# Altium schematic sheet FRDM-TFC.SchDoc: TRW-TFC
size D; SheetNumber: 1; SheetTotal: 2
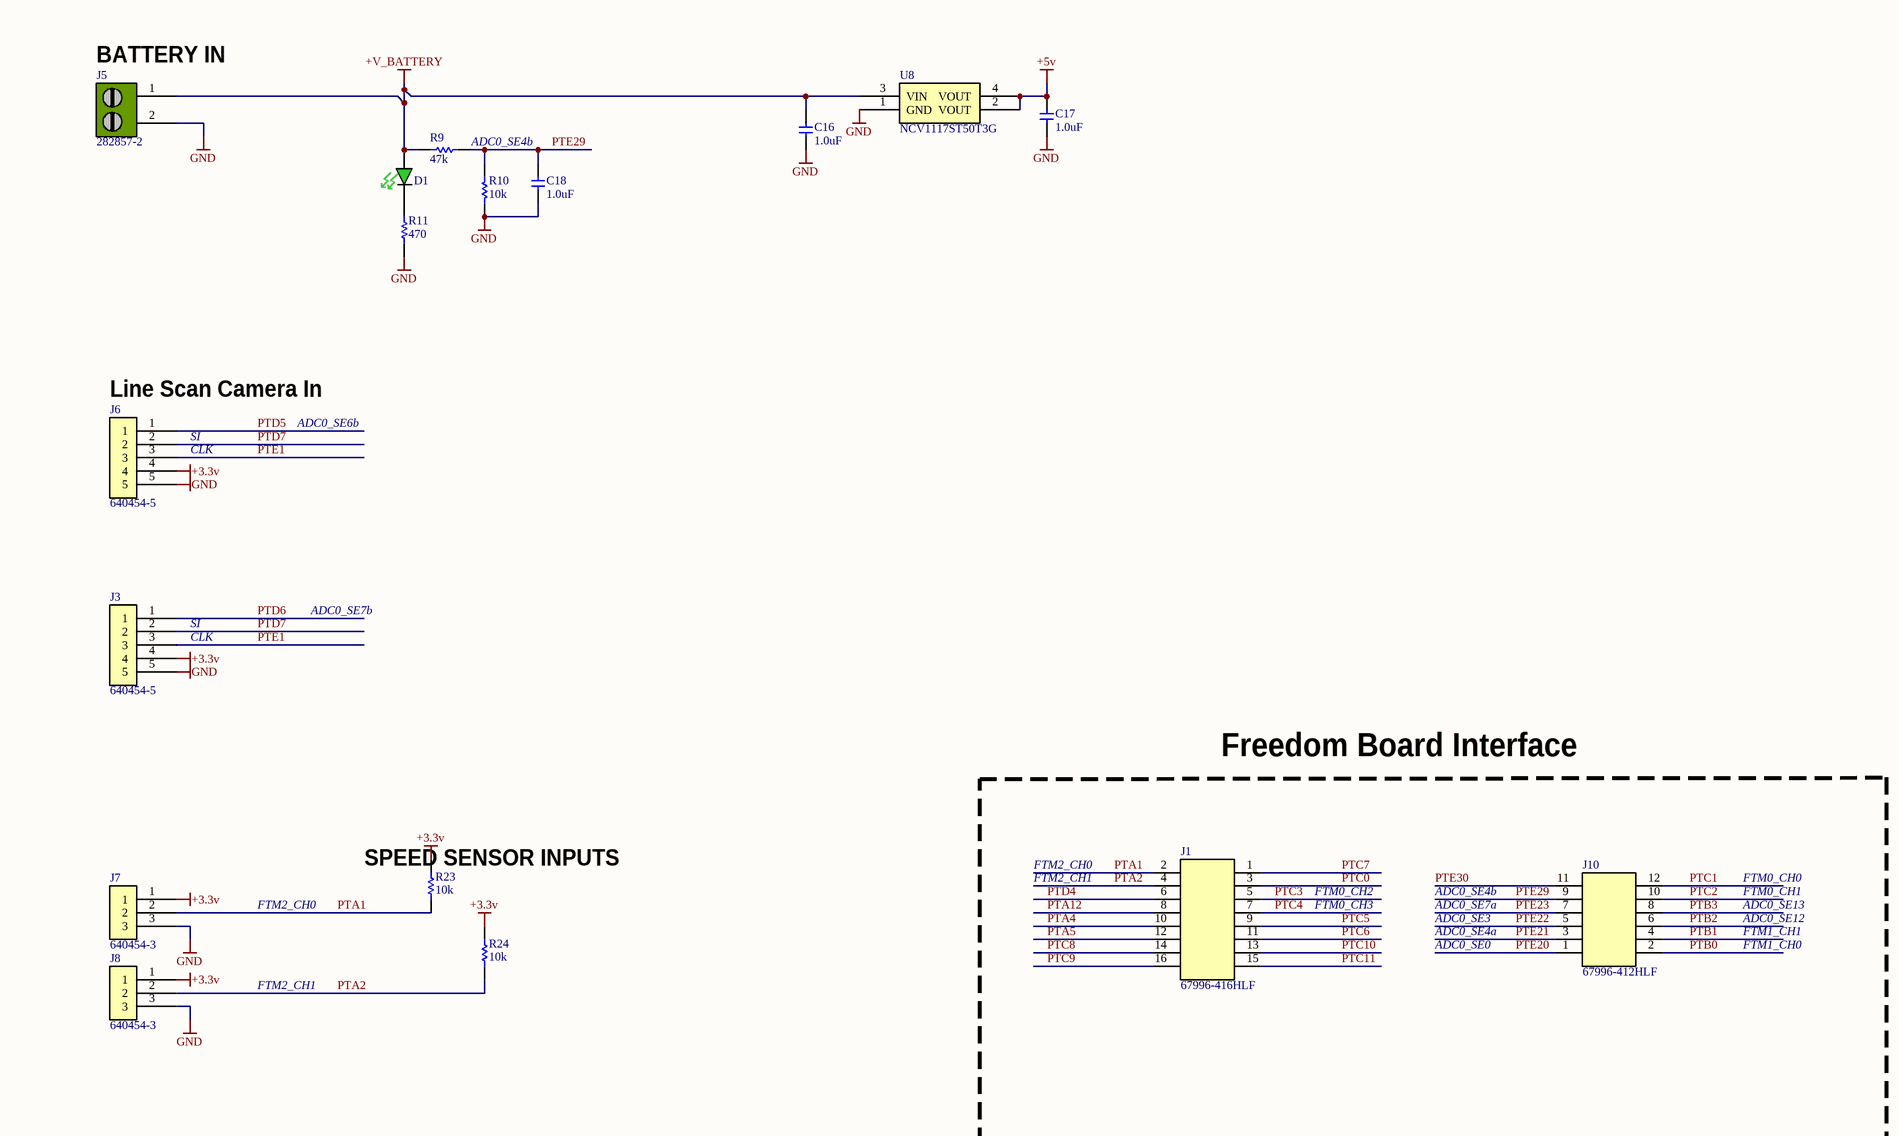
[diagram p0: FRDM-TFC.SchDoc, top left]
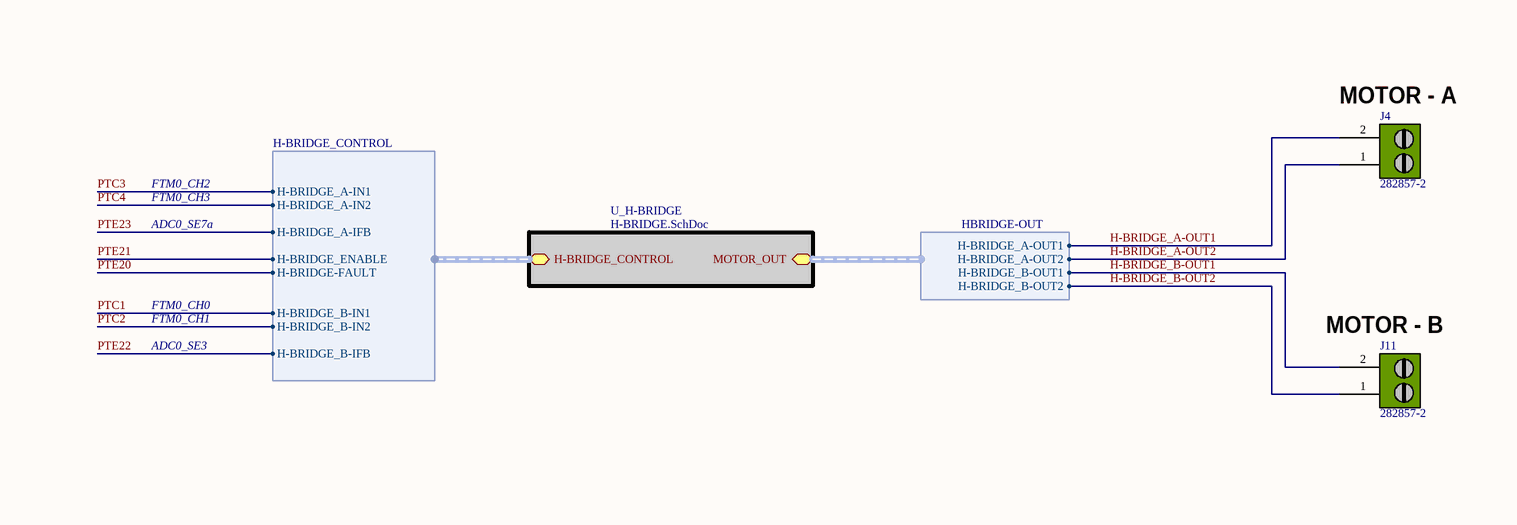
[diagram p1: FRDM-TFC.SchDoc, top right]
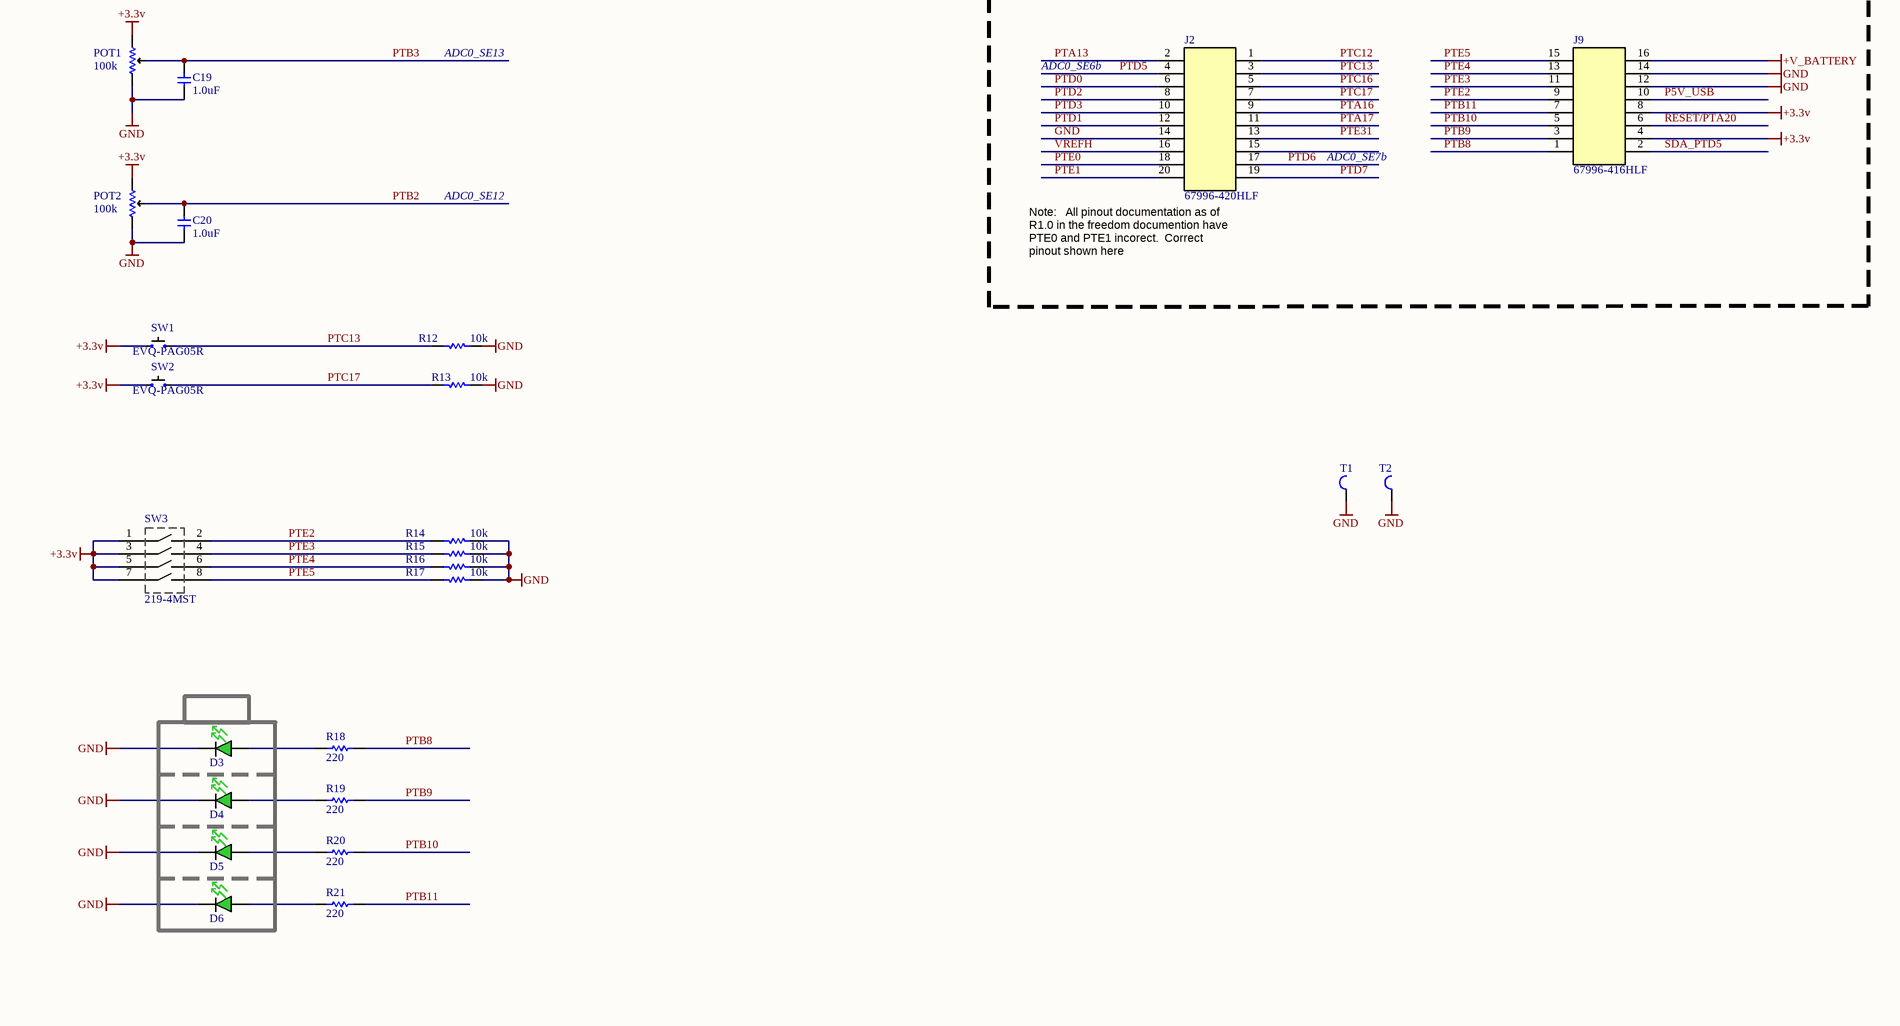
[diagram p2: FRDM-TFC.SchDoc, bottom left]
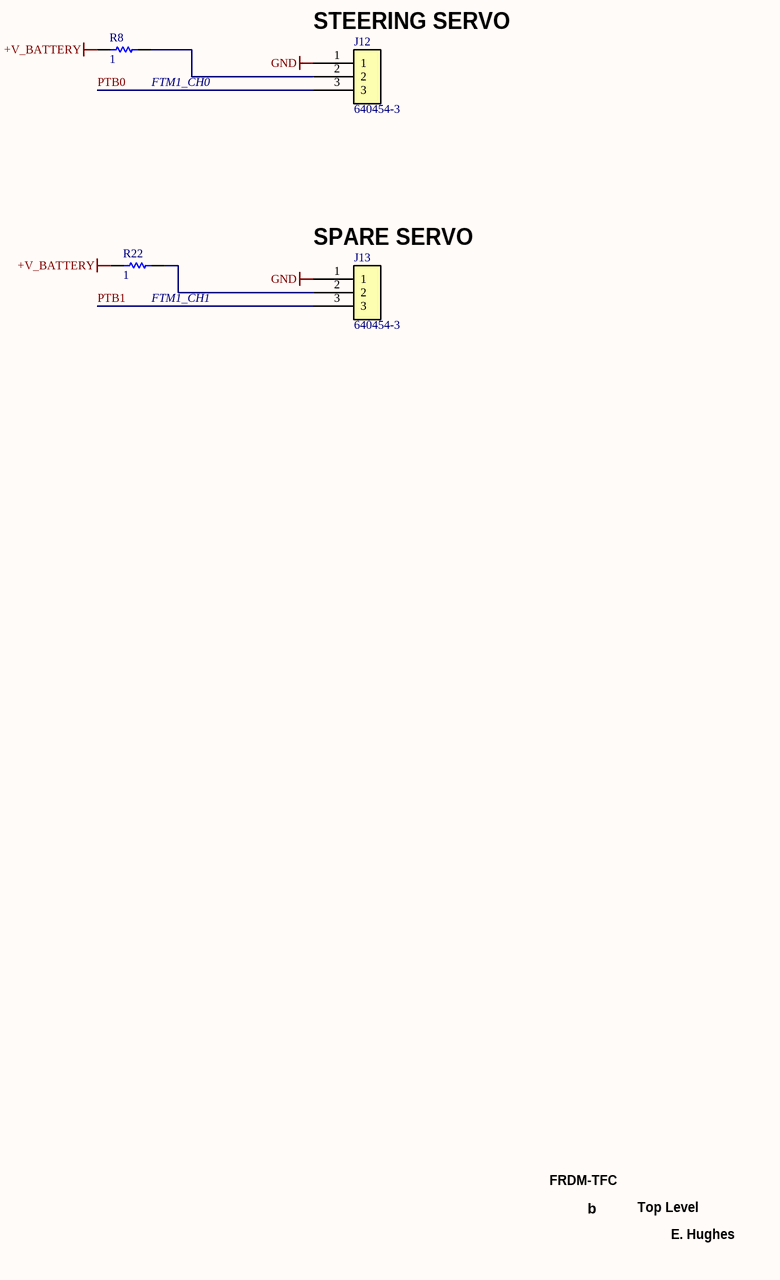
[diagram p3: FRDM-TFC.SchDoc, bottom right]

## Parts
C16  1.0uF  [C0805]
C17  1.0uF  [C0805]
C18  1.0uF  [C0805]
C19  1.0uF  [C0805]
C20  1.0uF  [C0805]
D1  (no value)  [LED_0805 - GREEN]
D3  (no value)  [LED_0805 - GREEN]
D4  (no value)  [LED_0805 - GREEN]
D5  (no value)  [LED_0805 - GREEN]
D6  (no value)  [LED_0805 - GREEN]
J1  67996-416HLF  [67996-416HLF]
J2  67996-420HLF  [67996-420HLF]
J3  640454-5  [640454-5]
J4  282857-2  [282857-2]
J5  282857-2  [282857-2]
J6  640454-5  [640454-5]
J7  640454-3  [640454-3]
J8  640454-3  [640454-3]
J9  67996-416HLF  [67996-416HLF]
J10  67996-412HLF  [67996-412HLF]
J11  282857-2  [282857-2]
J12  640454-3  [640454-3]
J13  640454-3  [640454-3]
POT1  100k  [3386P]
POT2  100k  [3386P]
R8  1  [R2512]
R9  47k  [R0603]
R10  10k  [R0603]
R11  470  [R0603]
R12  10k  [R0603]
R13  10k  [R0603]
R14  10k  [R0603]
R15  10k  [R0603]
R16  10k  [R0603]
R17  10k  [R0603]
R18  220  [R0603]
R19  220  [R0603]
R20  220  [R0603]
R21  220  [R0603]
R22  1  [R2512]
R23  10k  [R0603]
R24  10k  [R0603]
SW1  EVQ-PAG05R  [EVQ-PAG05R]
SW2  EVQ-PAG05R  [EVQ-PAG05R]
SW3  219-4MST  [219-4MST]
T1  PC TEST POINT MINIATURE SMT  [SMT_TEST_5015]  (value not drawn)
T2  PC TEST POINT MINIATURE SMT  [SMT_TEST_5015]  (value not drawn)
U8  NCV1117ST50T3G  [SOT223]

## Blocks framed on the sheet
Freedom Board Interface: J1 J2 J9 J10

## Sub-sheets
U_H-BRIDGE = H-BRIDGE.SchDoc: MOTOR_OUT (harness HBRIDGE-OUT), H-BRIDGE_CONTROL (harness H-BRIDGE_CONTROL)

## Harnesses
HBRIDGE-OUT: H-BRIDGE_A-OUT1, H-BRIDGE_A-OUT2, H-BRIDGE_B-OUT1, H-BRIDGE_B-OUT2
H-BRIDGE_CONTROL: H-BRIDGE_A-IN2, H-BRIDGE_A-IN1, H-BRIDGE_ENABLE, H-BRIDGE-FAULT, H-BRIDGE_A-IFB, H-BRIDGE_B-IN2, H-BRIDGE_B-IN1, H-BRIDGE_B-IFB

## Nets
+3.3v: J3.4 J6.4 J7.1 J8.1 J9.4 J9.8 POT1.1 POT2.1 R23.2 R24.2 SW1.A SW2.A SW3.1(A1) SW3.3(A2) SW3.5(A3) SW3.7(A4)
+5v: C17.1 U8.2(VOUT) U8.4(VOUT)
+V_BATTERY: C16.1 D1.A J5.1 J9.16 R8.1 R9.1 R22.1 U8.3(VIN)
GND: C16.2 C17.2 C18.1 C19.1 C20.1 D3.C D4.C D5.C D6.C J2.14 J3.5 J5.2 J6.5 J7.3 J8.3 J9.12 J9.14 J12.1 J13.1 POT1.3 POT2.3 R10.2 R11.1 R12.1 R13.1 R14.1 R15.1 R16.1 R17.1 T1.1 T2.1 U8.1(GND)
H-BRIDGE_A-OUT1: J4.2 ; sheet U_H-BRIDGE/MOTOR_OUT.H-BRIDGE_A-OUT1
H-BRIDGE_A-OUT2: J4.1 ; sheet U_H-BRIDGE/MOTOR_OUT.H-BRIDGE_A-OUT2
H-BRIDGE_B-OUT1: J11.2 ; sheet U_H-BRIDGE/MOTOR_OUT.H-BRIDGE_B-OUT1
H-BRIDGE_B-OUT2: J11.1 ; sheet U_H-BRIDGE/MOTOR_OUT.H-BRIDGE_B-OUT2
P5V_USB: J9.10
PTA1: J1.2 J7.2 R23.1
PTA2: J1.4 J8.2 R24.1
PTA4: J1.10
PTA5: J1.12
PTA12: J1.8
PTA13: J2.2
PTA16: J2.9
PTA17: J2.11
PTB0: J10.2 J12.3
PTB1: J10.4 J13.3
PTB2: C20.2 J10.6 POT2.2
PTB3: C19.2 J10.8 POT1.2
PTB8: J9.1 R18.1
PTB9: J9.3 R19.1
PTB10: J9.5 R20.1
PTB11: J9.7 R21.1
PTC0: J1.3
PTC1: J10.12 ; sheet U_H-BRIDGE/H-BRIDGE_CONTROL.H-BRIDGE_B-IN1
PTC2: J10.10 ; sheet U_H-BRIDGE/H-BRIDGE_CONTROL.H-BRIDGE_B-IN2
PTC3: J1.5 ; sheet U_H-BRIDGE/H-BRIDGE_CONTROL.H-BRIDGE_A-IN1
PTC4: J1.7 ; sheet U_H-BRIDGE/H-BRIDGE_CONTROL.H-BRIDGE_A-IN2
PTC5: J1.9
PTC6: J1.11
PTC7: J1.1
PTC8: J1.14
PTC9: J1.16
PTC10: J1.13
PTC11: J1.15
PTC12: J2.1
PTC13: J2.3 R12.2 SW1.B
PTC16: J2.5
PTC17: J2.7 R13.2 SW2.B
PTD0: J2.6
PTD1: J2.12
PTD2: J2.8
PTD3: J2.10
PTD4: J1.6
PTD5: J2.4 J6.1
PTD6: J2.17 J3.1
PTD7: J2.19 J3.2 J6.2
PTE0: J2.18
PTE1: J2.20 J3.3 J6.3
PTE2: J9.9 R14.2 SW3.2(B1)
PTE3: J9.11 R15.2 SW3.4(B2)
PTE4: J9.13 R16.2 SW3.6(B3)
PTE5: J9.15 R17.2 SW3.8(B4)
PTE20: J10.1 ; sheet U_H-BRIDGE/H-BRIDGE_CONTROL.H-BRIDGE-FAULT
PTE21: J10.3 ; sheet U_H-BRIDGE/H-BRIDGE_CONTROL.H-BRIDGE_ENABLE
PTE22: J10.5 ; sheet U_H-BRIDGE/H-BRIDGE_CONTROL.H-BRIDGE_B-IFB
PTE23: J10.7 ; sheet U_H-BRIDGE/H-BRIDGE_CONTROL.H-BRIDGE_A-IFB
PTE29: C18.2 J10.9 R9.2 R10.1
PTE30: J10.11
PTE31: J2.13
RESET/PTA20: J9.6
SDA_PTD5: J9.2
VREFH: J2.16
NetD1_C: D1.C R11.2
NetD3_A: D3.A R18.2
NetD4_A: D4.A R19.2
NetD5_A: D5.A R20.2
NetD6_A: D6.A R21.2
NetJ12_2: J12.2 R8.2
NetJ13_2: J13.2 R22.2

Not connected (* = marked no-connect by the designer): J2 15

## Notes on the sheet
- (near J5) BATTERY IN
- (near R9) ADC0_SE4b
- (near J6) Line Scan Camera In
- SI
- CLK
- ADC0_SE6b
- ADC0_SE7b
- (near J4) MOTOR - A
- (near J7) SPEED SENSOR INPUTS
- FTM2_CH0
- FTM0_CH2
- FTM2_CH1
- FTM0_CH3
- ADC0_SE4b
- ADC0_SE3
- ADC0_SE4a
- ADC0_SE7a
- FTM0_CH0
- FTM0_CH1
- FTM1_CH1
- ADC0_SE12
- ADC0_SE13
- ADC0_SE0
- FTM1_CH0
- (near J11) MOTOR - B
- (near J12) STEERING SERVO
- (near R8) FTM1_CH0
- (near J2) Note:   All pinout documentation as of R1.0 in the freedom documention have PTE0 and PTE1 incorect.  Correct pinout shown here
- (near R22) FTM1_CH1
- (near J13) SPARE SERVO
- FRDM-TFC
- b
- Top Level
- E. Hughes
- -1
- 2
- Wavenumber
- Technologies
- pl
- Rev:
- Sheet
- of

## Library data of the parts
C16-C20 = UMK212BJ105KG-T: CAP CER 1.0UF 50V X5R 0805; Manufacturer: Taiyo Yuden; Capacitance: 1.0µF; Tolerance: ±10%; Manufacturer Part Number: UMK212BJ105KG-T; Value: CAP CER 1.0UF 50V X5R 0805; Supplier 1: Digi-Key; Supplier Part Number 1: 587-2229-1-ND; RoHS: RoHS Compliant; Category: Capacitors; Stock 1: 302348; Pricing 1: 1=0.39, 10=0.26, 100=0.104, 250=0.07476, 500=0.0533, 1000=0.039 (USD); Voltage - Rated: 50V; Temperature Coefficient: X5R; Mounting Type: Surface Mount, MLCC; Operating Temperature: -55°C ~ 85°C; Features: -; Applications: General Purpose; Ratings: -; Package / Case: 0805 (2012 Metric); Size / Dimension: 0.079" L x 0.049" W (2.00mm x 1.25mm); Lead Spacing: -; Thickness: 1.25mm; Packaging: Cut Tape (CT); Lead Style: -; ComponentLink1URL: http://www.yuden.co.jp/ut/product/pdf/mlcc_all_e.pdf; ComponentLink1Description: http://www.yuden.co.jp/ut/product/pdf/mlcc_all_e.pdf
D1 D3-D6 = APT2012CGCK: LED 2X1.2MM 570NM GN WTR CLR SMD; Manufacturer: Kingbright Corp; Color: Green; Current - Test: 20mA; Wavelength - Peak: 574nm; Millicandela Rating: 50mcd; Voltage - Forward (Vf) Typ: 2.1V; Lens Type: Clear; Lens Style/Size: Rectangle, 1.3mm x 1.25mm; Viewing Angle: 120°; Supplier 1: Digi-Key; Supplier Part Number 1: 754-1127-1-ND; Manufacturer Part Number: APT2012CGCK; RoHS: RoHS Compliant; Category: Optoelectronics; Stock 1: 53690; Pricing 1: 1=0.17, 10=0.124, 25=0.0992, 100=0.0908, 250=0.08252, 500=0.07426, 1000=0.066 (USD); Luminous Flux @ Current - Test: -; Wavelength - Dominant: 570nm; Size / Dimension: 2.00mm L x 1.25mm W; Height: 0.75mm; Package / Case: 0805 (2012 Metric); Mounting Type: Surface Mount; Packaging: Cut Tape (CT); ComponentLink1URL: http://www.us.kingbright.com/images/catalog/SPEC/APT2012CGCK.pdf; ComponentLink1Description: http://www.us.kingbright.com/images/catalog/SPEC/APT2012CGCK.pdf; Supplier 2: Digi-Key; Supplier Part Number 2: 754-1124-1-ND
J1 J9 = 67996-416HLF: CONN HEADER 16POS .100 STR TIN; Manufacturer: FCI; Connector Type: Header, Unshrouded; Number of Positions: 16; Number of Positions Loaded: All; Pitch: 0.100" (2.54mm); Manufacturer Part Number: 67996-416HLF; RoHS: RoHS Compliant; Category: Connectors, Interconnects; Contact Type: Male Pin; Number of Rows: 2; Row Spacing: 0.100" (2.54mm); Contact Mating Length: 0.230" (5.84mm); Mounting Type: Through Hole; Termination: Solder; Fastening Type: -; Features: -; Contact Finish: Tin; Contact Finish Thickness: 100µin (2.54µm); Color: Black; Packaging: Bulk; ComponentLink1URL: http://portal.fciconnect.com/Comergent//fci/drawing/67996.pdf; ComponentLink1Description: http://portal.fciconnect.com/Comergent//fci/drawing/67996.pdf; Value: 67996-416HLF; Supplier 1: Digi-Key; Supplier Part Number 1: 609-3220-ND; Stock 1: 1589; Pricing 1: 1=0.56, 10=0.521, 25=0.4684, 50=0.4164, 100=0.3991, 250=0.36436, 500=0.347, 1000=0.28628, 2500=0.26025 (USD)
J2 = 67996-420HLF: CONN HEADER 20POS .100 STR TIN; Manufacturer: FCI; Connector Type: Header, Unshrouded; Number of Positions: 20; Number of Positions Loaded: All; Pitch: 0.100" (2.54mm); Supplier 1: Digi-Key; Supplier Part Number 1: 609-3221-ND; Manufacturer Part Number: 67996-420HLF; RoHS: RoHS Compliant; Category: Connectors, Interconnects; Stock 1: 596; Pricing 1: 1=0.66, 10=0.619, 25=0.5572, 50=0.4952, 100=0.4745, 250=0.43324, 500=0.4126, 1000=0.3404, 2500=0.30945 (USD); Contact Type: Male Pin; Number of Rows: 2; Row Spacing: 0.100" (2.54mm); Contact Mating Length: 0.230" (5.84mm); Mounting Type: Through Hole; Termination: Solder; Fastening Type: -; Features: -; Contact Finish: Tin; Contact Finish Thickness: 100µin (2.54µm); Color: Black; Packaging: Bulk; ComponentLink1URL: http://portal.fciconnect.com/Comergent//fci/drawing/67996.pdf; ComponentLink1Description: http://portal.fciconnect.com/Comergent//fci/drawing/67996.pdf
J3 J6 = 640454-5: CONN HEADER VERT 5POS .100 TIN; Manufacturer: TE Connectivity; Connector Type: Header, Unshrouded; Number of Positions: 5; Number of Positions Loaded: All; Pitch: 0.100" (2.54mm); Supplier 1: Digi-Key; Supplier Part Number 1: A19432-ND; Manufacturer Part Number: 640454-5; RoHS: RoHS Compliant; Category: Connectors, Interconnects; Stock 1: 21698; Pricing 1: 1=0.27, 10=0.254, 25=0.218, 50=0.1854, 100=0.1781, 250=0.15996, 500=0.15268, 1000=0.12723, 2500=0.11632 (USD); Contact Type: Male Pin; Number of Rows: 1; Row Spacing: -; Contact Mating Length: 0.295" (7.49mm); Mounting Type: Through Hole; Termination: Solder; Fastening Type: -; Features: Polarizing Key; Contact Finish: Tin; Contact Finish Thickness: -; Color: Natural; Packaging: Bulk; ComponentLink1URL: http://documents.tycoelectronics.com/commerce/DocumentDelivery/DDEController?Action=srchrtrv&DocNm=640454&DocType=CD&DocLang=EN; ComponentLink1Description: http://documents.tycoelectronics.com/commerce/DocumentDelivery/DDEController?Action=srchrtrv&DocNm=640454&DocType=CD&DocLang=EN; Value: 640454-5
J4 J5 J11 = 282857-2: TERM BLOCK 2POS SIDE ENT 5.08MM; Manufacturer: TE Connectivity; Number of Levels: 1; Positions Per Level: 2; Pitch: 0.200" (5.08mm); Mating Orientation: Horizontal with Board; Current: 24A; Voltage: 300V; Wire Gauge: 12-30 AWG; Wire Termination: Screw - Rising Cage Clamp; Clamp Material - Plating: Brass - Nickel Plated; Torque - Screw: 0.79 Nm (7.0 Lb-In); Screw Thread: M3; Supplier 1: Digi-Key; Supplier Part Number 1: A98359-ND; Manufacturer Part Number: 282857-2; RoHS: RoHS Compliant; Category: Connectors, Interconnects; Stock 1: 1811; Pricing 1: 1=1.19, 10=1.046, 25=0.984, 50=0.9432, 100=0.9021, 250=0.82012, 500=0.7381, 1000=0.65608, 2500=0.59457 (USD); Mounting Type: Through Hole; Features: Interlocking (Side); Color: Green; Packaging: Bulk; Operating Temperature: -; Housing Material: Polyamide (PA66), Nylon 6/6; Contact Material - Plating: Brass - Tin Plated; Screw Material - Plating: Brass - Nickel Plated; ComponentLink1URL: http://documents.tycoelectronics.com/commerce/DocumentDelivery/DDEController?Action=srchrtrv&DocNm=282857&DocType=CD&DocLang=EN; ComponentLink1Description: http://documents.tycoelectronics.com/commerce/DocumentDelivery/DDEController?Action=srchrtrv&DocNm=282857&DocType=CD&DocLang=EN; Value: 282857-2
J7 J8 J12 J13 = 640454-3: CONN HEADER VERT 3POS .100 TIN; Manufacturer: TE Connectivity; Connector Type: Header, Unshrouded; Number of Positions: 3; Number of Positions Loaded: All; Pitch: 0.100" (2.54mm); Supplier 1: Digi-Key; Supplier Part Number 1: A19430-ND; Manufacturer Part Number: 640454-3; RoHS: RoHS Compliant; Category: Connectors, Interconnects; Stock 1: 29104; Pricing 1: 1=0.17, 10=0.162, 25=0.1204, 50=0.1032, 100=0.0997, 250=0.08592, 500=0.08248, 1000=0.07218, 2500=0.0653 (USD); Contact Type: Male Pin; Number of Rows: 1; Row Spacing: -; Contact Mating Length: 0.295" (7.49mm); Mounting Type: Through Hole; Termination: Solder; Fastening Type: -; Features: Polarizing Key; Contact Finish: Tin; Contact Finish Thickness: -; Color: Natural; Packaging: Bulk; ComponentLink1URL: http://documents.tycoelectronics.com/commerce/DocumentDelivery/DDEController?Action=srchrtrv&DocNm=640454&DocType=CD&DocLang=EN; ComponentLink1Description: http://documents.tycoelectronics.com/commerce/DocumentDelivery/DDEController?Action=srchrtrv&DocNm=640454&DocType=CD&DocLang=EN; Value: 640454-3
J10 = 67996-412HLF: CONN HEADER 12POS .100 STR TIN; Manufacturer: FCI; Connector Type: Header, Unshrouded; Number of Positions: 12; Number of Positions Loaded: All; Pitch: 0.100" (2.54mm); Supplier 1: Digi-Key; Supplier Part Number 1: 609-3219-ND; Manufacturer Part Number: 67996-412HLF; RoHS: RoHS Compliant; Category: Connectors, Interconnects; Stock 1: 1044; Pricing 1: 1=0.4, 10=0.379, 25=0.3248, 50=0.276, 100=0.2651, 250=0.23804, 500=0.22722, 1000=0.18935, 2500=0.17312 (USD); Contact Type: Male Pin; Number of Rows: 2; Row Spacing: 0.100" (2.54mm); Contact Mating Length: 0.230" (5.84mm); Mounting Type: Through Hole; Termination: Solder; Fastening Type: -; Features: -; Contact Finish: Tin; Contact Finish Thickness: 100µin (2.54µm); Color: Black; Packaging: Bulk; ComponentLink1URL: http://portal.fciconnect.com/Comergent//fci/drawing/67996.pdf; ComponentLink1Description: http://portal.fciconnect.com/Comergent//fci/drawing/67996.pdf; Value: 67996-412HLF
POT1 POT2 = 3386P-1-104TLF: TRIMMER 100K OHM 0.5W TH; Manufacturer: Bourns Inc.; Power (Watts): 0.5W, 1/2W; Tolerance: ±10%; Temperature Coefficient: ±100ppm/°C; Number of Turns: Single; Adjustment Type: Top Adjustment; Resistive Material: Cermet; Value: 100k; Sort Value: *; Supplier 1: Digi-Key; Supplier Part Number 1: 3386P-104TLF-ND; RoHS: RoHS Compliant; Category: Potentiometers, Variable Resistors; Stock 1: 699; Pricing 1: 1=2.63, 10=2.325, 50=2.025, 100=1.665, 500=1.3875, 1000=1.17 (USD); Resistance (Ohms): 100K; Mounting Type: Through Hole; Termination Style: PC Pin; Packaging: Tube; Size / Dimension: Square - 0.375" L x 0.375" W x 0.190" H (9.52mm x 9.52mm x 4.83mm); ComponentLink1URL: http://www.bourns.com/data/global/PDFs/3386.pdf; ComponentLink1Description: http://www.bourns.com/data/global/PDFs/3386.pdf; Manufacturer Part Number: 3386P-1-104TLF
R8 R22 = ERJ-1TYJ1R0U: RES 1.0 OHM 1W 5% 2512 SMD; Manufacturer: Panasonic Electronic Components; Temperature Coefficient: -100/ +600ppm/°C; Supplier 1: Digi-Key; Manufacturer Part Number: ERJ-1TYJ1R0U; RoHS: RoHS Compliant; Category: Resistors; Stock 1: 209796; Pricing 1: 1=0.8, 50=0.33, 100=0.2727, 250=0.21524, 500=0.18368, 1000=0.13776 (USD); Resistance (Ohms): 1; Power (Watts): 1W; Composition: Thick Film; Features: -; Tolerance: ±5%; Package / Case: 2512 (6432 Metric); Supplier Device Package: 2512; Size / Dimension: 0.252" L x 0.126" W (6.40mm x 3.20mm); Height: 0.028" (0.70mm); Number of Terminations: 2; Packaging: Cut Tape (CT); ComponentLink1URL: http://industrial.panasonic.com/www-cgi/jvcr13pz.cgi?E+PZ+3+AOA0001+ERJ1TYJ1R0U+7+WW; ComponentLink1Description: http://industrial.panasonic.com/www-cgi/jvcr13pz.cgi?E+PZ+3+AOA0001+ERJ1TYJ1R0U+7+WW; Supplier Part Number 1: PT1.0XCT-ND; Value: 1
R9 = ERJ-3EKF4702V: RES 47.0K OHM 1/10W 1% 0603 SMD; Manufacturer: Panasonic - ECG; Power (Watts): 0.1W, 1/10W; Temperature Coefficient: ±100ppm/°C; Manufacturer Part Number: ERJ-3EKF4702V; Value: RES 47.0K OHM 1/10W 1% 0603 SMD; Supplier 1: Digi-Key; Supplier Part Number 1: P47.0KHCT-ND; RoHS: RoHS Compliant; Category: Resistors; Stock 1: 234726; Pricing 1: 1=0.04, 50=0.015, 100=0.0114, 250=0.00844, 500=0.00624, 1000=0.00416 (USD); Resistance (Ohms): 47K; Composition: Thick Film; Features: -; Tolerance: ±1%; Size / Dimension: 0.063" L x 0.031" W (1.60mm x 0.80mm); Height: 0.018" (0.45mm); Lead Style: Surface Mount (SMD - SMT); Packaging: Cut Tape (CT); Package / Case: 0603 (1608 Metric); ComponentLink1URL: http://industrial.panasonic.com/www-cgi/jvcr13pz.cgi?E+PZ+3+AOA0002+ERJ3EKF4702V+7+WW; ComponentLink1Description: http://industrial.panasonic.com/www-cgi/jvcr13pz.cgi?E+PZ+3+AOA0002+ERJ3EKF4702V+7+WW
R10 R12-R17 = ERJ-3EKF1002V: RES 10.0K OHM 1/10W 1% 0603 SMD; Manufacturer: Panasonic - ECG; Power (Watts): 0.1W, 1/10W; Temperature Coefficient: ±100ppm/°C; Manufacturer Part Number: ERJ-3EKF1002V; Value: 10k; Supplier 1: Digi-Key; RoHS: RoHS Compliant; Category: Resistors; Stock 1: 11168880; Pricing 1: 1=0.04, 50=0.015, 100=0.0114, 250=0.00844, 500=0.00624, 1000=0.00416 (USD); Resistance (Ohms): 10.0K; Composition: Thick Film; Features: -; Tolerance: ±1%; Size / Dimension: 0.063" L x 0.031" W (1.60mm x 0.80mm); Height: 0.018" (0.45mm); Lead Style: Surface Mount (SMD - SMT); Packaging: Cut Tape (CT); Package / Case: 0603 (1608 Metric); ComponentLink1URL: http://industrial.panasonic.com/www-cgi/jvcr13pz.cgi?E+PZ+3+AOA0002+ERJ3EKF1002V+7+WW; ComponentLink1Description: http://industrial.panasonic.com/www-cgi/jvcr13pz.cgi?E+PZ+3+AOA0002+ERJ3EKF1002V+7+WW; Supplier Part Number 1: P10.0KHCT-ND
R11 = ERJ-3EKF4700V: RES 470 OHM 1/10W 1% 0603 SMD; Manufacturer: Panasonic - ECG; Power (Watts): 0.1W, 1/10W; Temperature Coefficient: ±100ppm/°C; Manufacturer Part Number: ERJ-3EKF4700V; Value: RES 470 OHM 1/10W 1% 0603 SMD; Supplier 1: Digi-Key; Supplier Part Number 1: P470HCT-ND; RoHS: RoHS Compliant; Category: Resistors; Stock 1: 1087324; Pricing 1: 1=0.04, 50=0.015, 100=0.0114, 250=0.00844, 500=0.00624, 1000=0.00416 (USD); Resistance (Ohms): 470; Composition: Thick Film; Features: -; Tolerance: ±1%; Size / Dimension: 0.063" L x 0.031" W (1.60mm x 0.80mm); Height: 0.018" (0.45mm); Lead Style: Surface Mount (SMD - SMT); Packaging: Cut Tape (CT); Package / Case: 0603 (1608 Metric); ComponentLink1URL: http://industrial.panasonic.com/www-cgi/jvcr13pz.cgi?E+PZ+3+AOA0002+ERJ3EKF4700V+7+WW; ComponentLink1Description: http://industrial.panasonic.com/www-cgi/jvcr13pz.cgi?E+PZ+3+AOA0002+ERJ3EKF4700V+7+WW
R18-R21 = ERJ-3EKF2200V: RES 220 OHM 1/10W 1% 0603 SMD; Manufacturer: Panasonic - ECG; Power (Watts): 0.1W, 1/10W; Temperature Coefficient: ±100ppm/°C; Supplier 1: Digi-Key; Supplier Part Number 1: P220HCT-ND; Manufacturer Part Number: ERJ-3EKF2200V; RoHS: RoHS Compliant; Category: Resistors; Stock 1: 365530; Pricing 1: 1=0.04, 50=0.0138, 100=0.0105, 250=0.0078, 500=0.00576, 1000=0.00384 (USD); Resistance (Ohms): 220; Composition: Thick Film; Features: -; Tolerance: ±1%; Size / Dimension: 0.063" L x 0.031" W (1.60mm x 0.80mm); Height: 0.022" (0.55mm); Number of Terminations: 2; Packaging: Cut Tape (CT); Package / Case: 0603 (1608 Metric); ComponentLink1URL: http://industrial.panasonic.com/www-cgi/jvcr13pz.cgi?E+PZ+3+AOA0002+ERJ3EKF2200V+7+WW; ComponentLink1Description: http://industrial.panasonic.com/www-cgi/jvcr13pz.cgi?E+PZ+3+AOA0002+ERJ3EKF2200V+7+WW; Value: 220
R23 R24 = ERJ-3EKF1002V: RES 10.0K OHM 1/10W 1% 0603 SMD; Source Part Number: P10.0KHCT-ND; Manufacturer: Panasonic - ECG; Power (Watts): 0.1W, 1/10W; Temperature Coefficient: ±100ppm/°C; Source: Digikey; ROHS Certificate: *; RoHS: RoHS Compliant; Category: Resistors; Resistance In Ohms: 10.0K; Composition: Thick Film; Features: -; Tolerance: ±1%; Case: 0603 (1608 metric); Size / Dimension: 0.063" L x 0.031" W (1.60mm x 0.80mm); Height: 0.018" (0.45mm); Lead Style: Surface Mount (SMD - SMT); Packaging: Cut Tape (CT); ComponentLink1URL: http://industrial.panasonic.com/www-cgi/jvcr13pz.cgi?E+PZ+3+AOA0002+ERJ3EKF1002V+7+WW; ComponentLink1Description: http://industrial.panasonic.com/www-cgi/jvcr13pz.cgi?E+PZ+3+AOA0002+ERJ3EKF1002V+7+WW; Manufacturer Part Number: ERJ-3EKF1002V; Supplier 1: Digi-Key; Stock 1: 10570746; Pricing 1: 1=0.04, 50=0.015, 100=0.0114, 250=0.00844, 500=0.00624, 1000=0.00416 (USD); Supplier Part Number 1: P10.0KHCT-ND; Value: 10k
SW1 SW2 = EVQ-PAG05R: SWITCH LT 6MM 260GF 5MM HEIGHT; Manufacturer: Panasonic - ECG; Source Part Number: P12195S-ND; Circuit: SPST-NO; Switch Function: Off-Mom; Contact Rating @ Voltage: 0.02A @ 15VDC; Actuator Type: Standard; Outline: 6.00mm x 6.00mm; Illumination: Non-Illuminated; Manufacturer Part Number: EVQ-PAG05R; Source: Digikey; Value: EVQ-PAG05R; Supplier 1: Digi-Key; Supplier Part Number 1: P12195S-ND; RoHS: RoHS Compliant; Category: Switches; Stock 1: 958; Pricing 1: 1=0.23, 10=0.189, 100=0.1583, 500=0.13572, 1000=0.1131, 5000=0.10028 (USD); Mounting Type: Through Hole; Orientation: Vertical; Operating Force: 260gf; Packaging: Bulk; ComponentLink1URL: http://industrial.panasonic.com/www-data/pdf/ATK0000/ATK0000CE10.pdf; ComponentLink1Description: http://industrial.panasonic.com/www-data/pdf/ATK0000/ATK0000CE10.pdf
SW3 = 219-4MST: SWITCH TAPE SEAL 4 POS SMD; Manufacturer: CTS Electrocomponents; Circuit: SPST; Number of Positions: 4; Contact Rating @ Voltage: 0.1A @ 50VDC; Actuator Type: Standard; Actuator Level: Raised; Washable: Yes; Supplier 1: Digi-Key; Supplier Part Number 1: CT2194MST-ND; Manufacturer Part Number: 219-4MST; RoHS: RoHS Compliant; Category: Switches; Stock 1: 23576; Pricing 1: 1=0.78, 10=0.689, 100=0.594, 500=0.486, 1000=0.432, 5000=0.378 (USD); Mounting Type: Surface Mount; Orientation: Top Actuated; ComponentLink1URL: http://www.ctscorp.com/components/Datasheets/219.pdf; ComponentLink1Description: http://www.ctscorp.com/components/Datasheets/219.pdf; Value: 219-4MST
T1 T2 = 5015: Manufacturer: Keystone Electronics; Type: PC Test Point, Miniature; Material: Phosphor Bronze; Supplier Part Number 1: 5015KCT-ND; Manufacturer Part Number: 5015; ROHS Certificate: *; Value: PC TEST POINT MINIATURE SMT; Pricing: *; Supplier 1: Digi-Key; RoHS: RoHS Compliant; Category: Test and Measurement; Stock 1: 850880; Pricing 1: 1=0.44, 10=0.413, 50=0.301, 100=0.2891, 250=0.25964, 500=0.24784 (USD); Terminal: 0.010" (0.25mm) Phosphor Bronze, Silver Plate; Mounting Type: Surface Mount; Color: -; Packaging: Cut Tape (CT); ComponentLink1URL: http://mail.keyelco.com/ENG._DEPT/PDF%20CAT%20NO%20Drawings/5015.pdf; ComponentLink1Description: http://mail.keyelco.com/ENG._DEPT/PDF%20CAT%20NO%20Drawings/5015.pdf
U8 = NCV1117ST50T3G: Low Dropout (LDO) Regulators ANA 800mA LDO; Manufacturer: ON Semiconductor; Input Voltage MAX: 20 V; Number of Outputs: 1; Output Current: 1 A; Output Type: Fixed; Output Voltage: 5 V; Dropout Voltage (Max): 1.1 V at 100 mA; Voltage Regulation Accuracy: 1 %; Line Regulation: 0.9 mV; Load Regulation: 6.7 mV; Polarity: Positive; Supplier 1: Mouser; Supplier Part Number 1: 863-NCV1117ST50T3G; Manufacturer Part Number: NCV1117ST50T3G; RoHS: RoHS Compliant; Category: Low Dropout (LDO) Regulators; Stock 1: 429; Pricing 1: 1=1.34, 25=1.05, 100=0.826, 500=0.738, 1000=0.581, 2000=0.493, 4000=0.493, 5000=0.468, 10000=0.450 (AUD); Package / Case: SOT-223-4; Packaging: Reel; Mounting Style: SMD/SMT; Maximum Operating Temperature: + 125 C; Minimum Operating Temperature: - 40 C; Product Category: Linear Regulators- Low Drop Out; Standard Pack Qty: 4000; RoHS - Mouser: Y; Minimum Order Quantity: 1; Reeling: True; ComponentLink1URL: http://www.onsemi.com/pub/Collateral/NCP1117-D.PDF; ComponentLink1Description: http://www.onsemi.com/pub/Collateral/NCP1117-D.PDF; Value: NCV1117ST50T3G